# Altium schematic sheet ESP32.SchDoc
size A
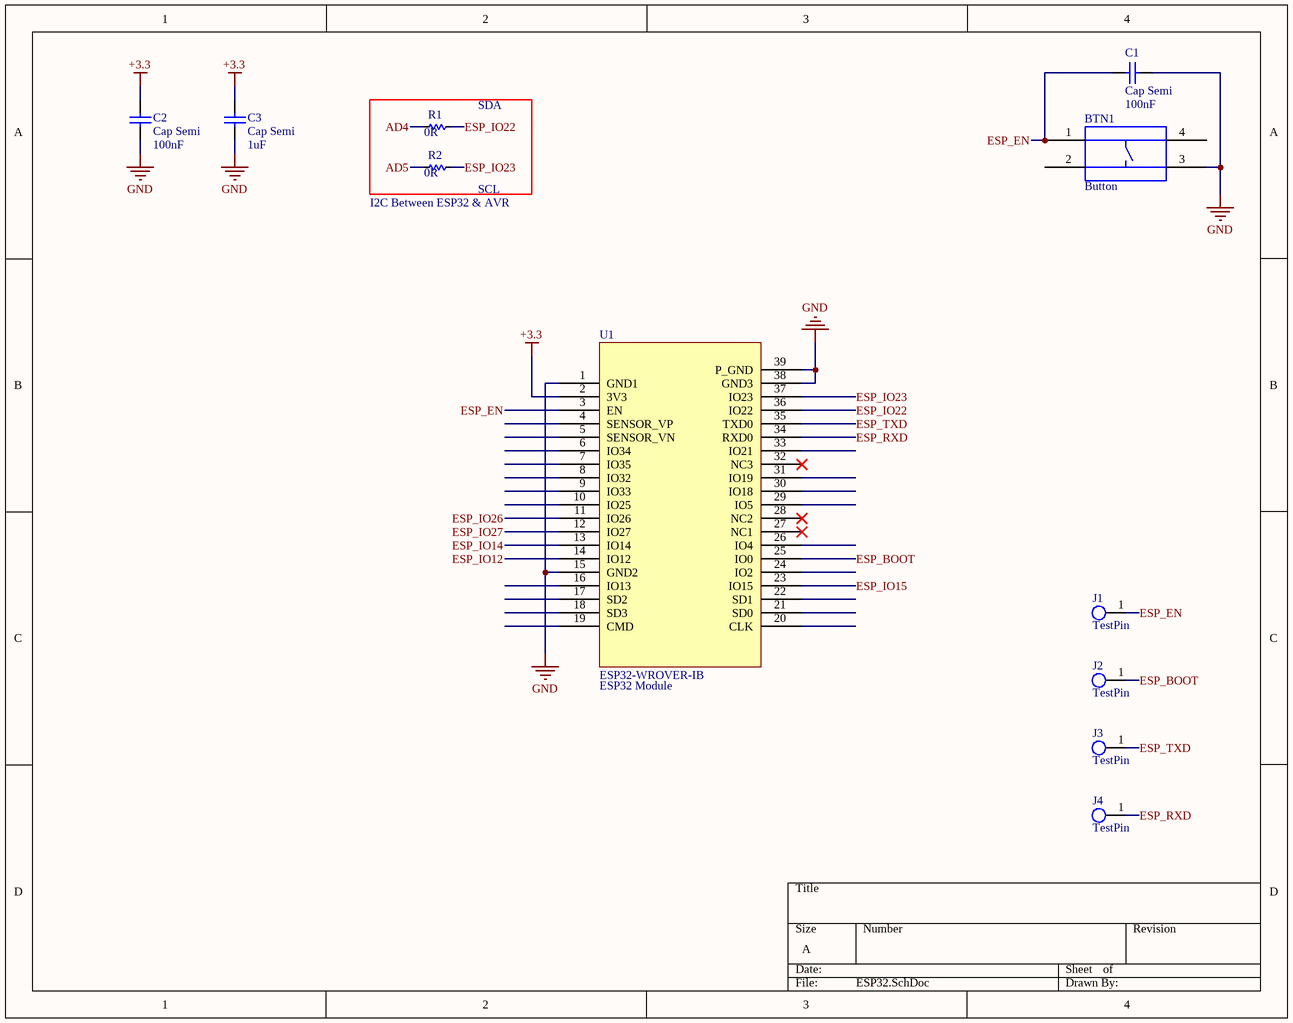
[diagram p0: ESP32.SchDoc]

## Parts
BTN1  Button  [TactileButton_4x4]
C1  Cap Semi  value 100nF  [1608[0603]]
C2  Cap Semi  value 100nF  [1608[0603]]
C3  Cap Semi  value 1uF  [1608[0603]]
J1  TestPin  [TestPin_1mm]
J2  TestPin  [TestPin_1mm]
J3  TestPin  [TestPin_1mm]
J4  TestPin  [TestPin_1mm]
R1  value 0R  [RES-SMD-0603]  (hidden comment: Res)
R2  value 0R  [RES-SMD-0603]  (hidden comment: Res)
U1  ESP32 Module  [ESP32-WROVER-IB]

## Nets
+3.3: C2.2 C3.2 U1.2(3V3)
GND: BTN1.3(Pin3) C1.1 C2.1 C3.1 U1.1(GND1) U1.15(GND2) U1.38(GND3) U1.39(P_GND)
AD4: R1.2
AD5: R2.2
ESP_BOOT: J2.1 U1.25(IO0)
ESP_EN: BTN1.1(Pin1) C1.2 J1.1 U1.3(EN)
ESP_IO12: U1.14(IO12)
ESP_IO14: U1.13(IO14)
ESP_IO15: U1.23(IO15)
ESP_IO22: R1.1 U1.36(IO22)
ESP_IO23: R2.1 U1.37(IO23)
ESP_IO26: U1.11(IO26)
ESP_IO27: U1.12(IO27)
ESP_RXD: J4.1 U1.34(RXD0)
ESP_TXD: J3.1 U1.35(TXD0)

Not connected (* = marked no-connect by the designer): BTN1 2(Pin2) 4(Pin4); U1 4(SENSOR_VP) 5(SENSOR_VN) 6(IO34) 7(IO35) 8(IO32) 9(IO33) 10(IO25) 16(IO13) 17(SD2) 18(SD3) 19(CMD) 20(CLK) 21(SD0) 22(SD1) 24(IO2) 26(IO4) 27(NC1)* 28(NC2)* 29(IO5) 30(IO18) 31(IO19) 32(NC3)* 33(IO21)

## Notes on the sheet
- (near R1) SDA
- (near R2) I2C Between ESP32 & AVR
- (near R2) SCL

## Library data of the parts
BTN1 = Tactile_4x4
C1-C3 = Cap Semi: Capacitor (Semiconductor SIM Model); Published: 8-Jun-2000; LatestRevisionDate: 29-May-2009; LatestRevisionNote: IPC-7351 Footprint Added.; PackageReference: C1206; Publisher: Altium Limited; PackageDescription: Chip Capacitor
J1-J4 = TestPin_1mm: Test conntact for pogo pins
R1 R2 = Res-SMD: Resistor; Manufacturer: Generic Components; Class: Passive; Published: 08/06/2000; Publisher: Altium Hobart Technology Centre
U1 = ESP32-WROVER-IB: Multiprotocol Modules SMD Module M213DH3264UH3Q0, ESP32-D0WD, 64Mbits PSRAM, 4 MB SPI flash, IPEX Antenna connector; Manufacturer: Espressif Systems; Value: ESP32-WROVER-IB